# Altium project 农联网.PrjPcb
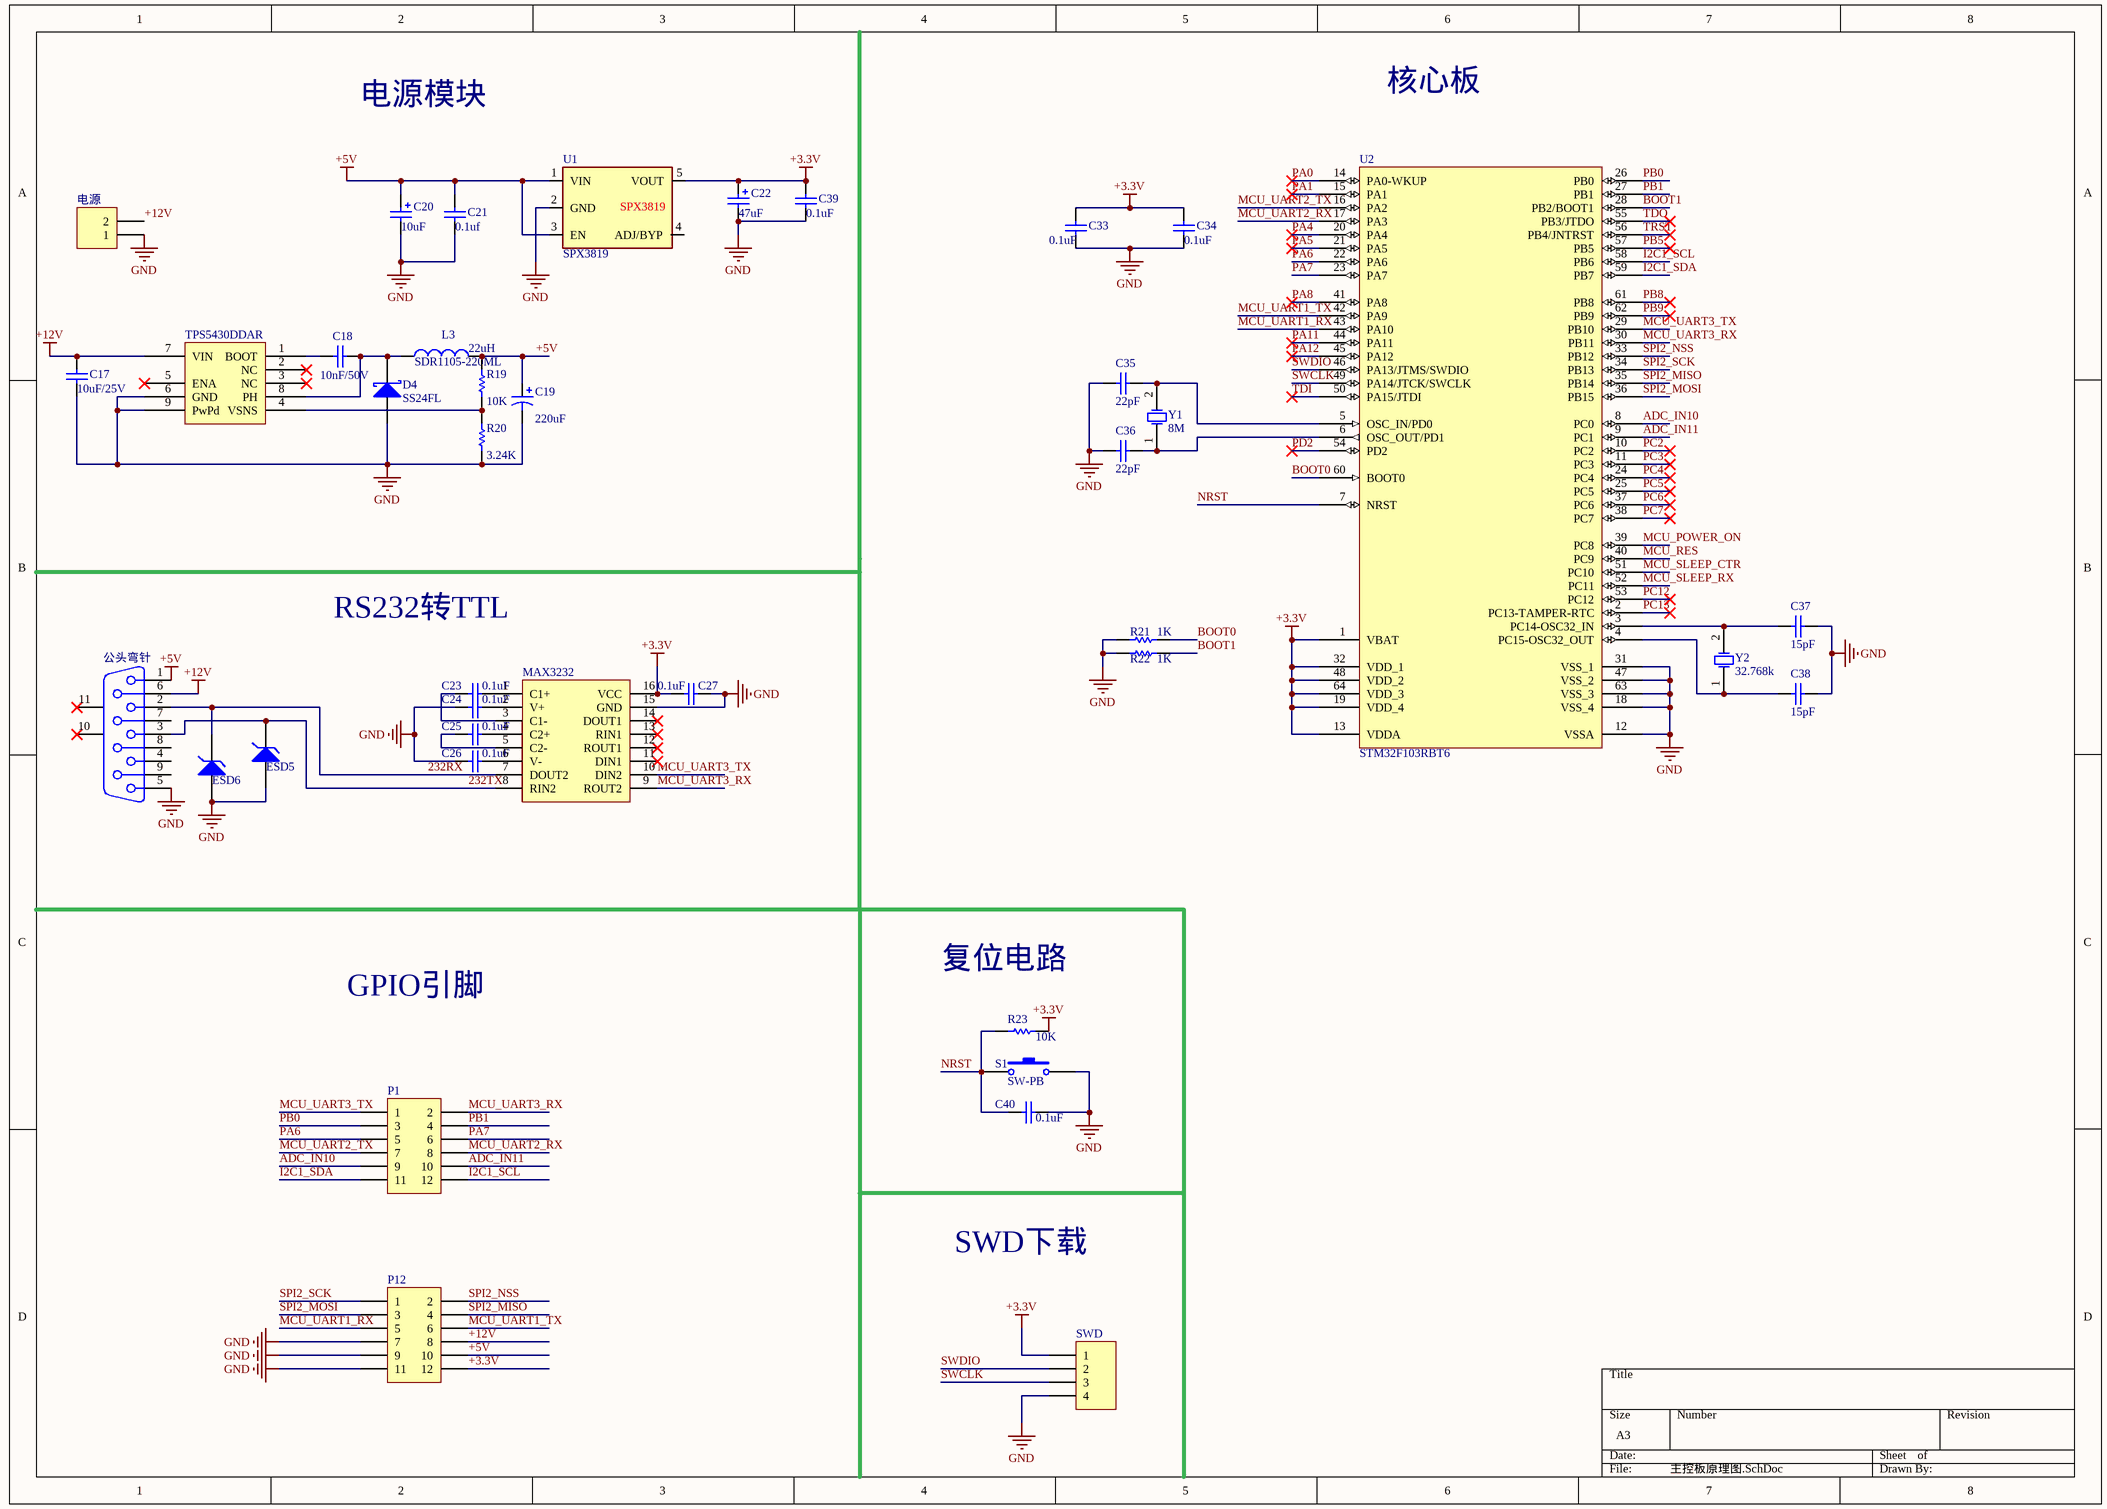
[diagram p0: 主控板原理图.SchDoc]
1 sheet, 40 parts. Net scope: global (net labels, ports and power ports of the same name join across sheets).
Board file: 农联网PCB.PcbDoc

## Sheet 主控板原理图.SchDoc
size A3

### Parts
C17  value 10uF/25V  [1206]  (hidden comment: GRM31CR61E106KA12L)
C18  value 10nF/50V  [0805]  (hidden comment: C0805C103K5RACTU)
C19  value 220uF  [钽电容(B)]  (hidden comment: 6TPE220MAZB)
C20  value 10uF  [1206]  (hidden comment: C1206-10uF)
C21  value 0.1uf  [0805]  (hidden comment: 104)
C22  value 47uF  [1206]  (hidden comment: C1206-47uF)
C23  value 0.1uF  [0805]  (hidden comment: 104)
C24  value 0.1uF  [0805]  (hidden comment: 104)
C25  value 0.1uF  [0805]  (hidden comment: 104)
C26  value 0.1uF  [0805]  (hidden comment: 104)
C27  value 0.1uF  [0805]  (hidden comment: 104)
C33  value 0.1uF  [0805]  (hidden comment: 104)
C34  value 0.1uF  [0805]  (hidden comment: 104)
C35  value 22pF  [0805]  (hidden comment: 22)
C36  value 22pF  [0805]  (hidden comment: 22)
C37  value 15pF  [0805]  (hidden comment: 15)
C38  value 15pF  [0805]  (hidden comment: 15)
C39  value 0.1uF  [0805]  (hidden comment: 104)
C40  value 0.1uF  [0805]  (hidden comment: 104)
D4  SS24FL  [SS24fl]
ESD5  SZESD7361HT1G  [0603]  (value not drawn)
ESD6  SZESD7361HT1G  [0603]  (value not drawn)
L3  SDR1105-220ML  value 22uH  [inductor]
MAX3232  MAX3232  [MAX3232]  (value not drawn)
P1  Header 6X2  [HDR6*2]  (value not drawn)
P12  Header 6X2  [HDR6*2]  (value not drawn)
R19  10K  [0805]
R20  3.24K  [0805]
R21  1K  [0805]
R22  1K  [0805]
R23  10K  [0805]
S1  SW-PB  [key]
SWD  Header 4  [SWD]  (value not drawn)
TPS5430DDAR  TPS5430DDAR  [TPS5430]  (value not drawn)
U1  SPX3819  [SOT-23-5]
U2  STM32F103RBT6  [STM32f103RBT6]
Y1  8M  [XTAL-B]
Y2  32.768k  [XTAL-B]
公头弯针  RS232公头弯针  [RS232]  (value not drawn)
电源  DUANZI  [DUANZI]  (value not drawn)

### Nets
+3.3V: C22.1 C27.2 C33.1 C34.1 C39.2 MAX3232.16(VCC) P12.12 R23.2 SWD.1 U1.5(VOUT) U2.1(VBAT) U2.13(VDDA) U2.19(VDD_4) U2.32(VDD_1) U2.48(VDD_2) U2.64(VDD_3)
+5V: C19.1 C20.1 C21.2 L3.2 P12.10 R19.2 U1.1(VIN) U1.3(EN) 公头弯针.1
+12V: C17.1 P12.8 TPS5430DDAR.7(VIN) 公头弯针.6 电源.2
GND: C17.2 C19.2 C20.2 C21.1 C22.2 C24.1 C26.1 C27.1 C33.2 C34.2 C35.1 C36.1 C37.2 C38.2 C39.1 C40.2 D4.1(A) ESD5.1(A) ESD6.1(A) MAX3232.15(GND) P12.7 P12.9 P12.11 R20.1 R21.2 R22.2 S1.2 SWD.4 TPS5430DDAR.6(GND) TPS5430DDAR.9(PwPd) U1.2(GND) U2.12(VSSA) U2.18(VSS_4) U2.31(VSS_1) U2.47(VSS_2) U2.63(VSS_3) 公头弯针.5 电源.1
232RX: ESD6.2(K) MAX3232.7(DOUT2) 公头弯针.2
232TX: ESD5.2(K) MAX3232.8(RIN2) 公头弯针.3
ADC_IN10: P1.9 U2.8(PC0)
ADC_IN11: P1.10 U2.9(PC1)
BOOT0: R21.1 U2.60(BOOT0)
BOOT1: R22.1 U2.28(PB2/BOOT1)
I2C1_SCL: P1.12 U2.58(PB6)
I2C1_SDA: P1.11 U2.59(PB7)
MCU_POWER_ON: U2.39(PC8)
MCU_RES: U2.40(PC9)
MCU_SLEEP_CTR: U2.51(PC10)
MCU_SLEEP_RX: U2.52(PC11)
MCU_UART1_RX: P12.5 U2.43(PA10)
MCU_UART1_TX: P12.6 U2.42(PA9)
MCU_UART2_RX: P1.8 U2.17(PA3)
MCU_UART2_TX: P1.7 U2.16(PA2)
MCU_UART3_RX: MAX3232.9(ROUT2) P1.2 U2.30(PB11)
MCU_UART3_TX: MAX3232.10(DIN2) P1.1 U2.29(PB10)
NRST: C40.1 R23.1 S1.1 U2.7(NRST)
PA0: U2.14(PA0-WKUP)
PA1: U2.15(PA1)
PA4: U2.20(PA4)
PA5: U2.21(PA5)
PA6: P1.5 U2.22(PA6)
PA7: P1.6 U2.23(PA7)
PA8: U2.41(PA8)
PA11: U2.44(PA11)
PA12: U2.45(PA12)
PB0: P1.3 U2.26(PB0)
PB1: P1.4 U2.27(PB1)
PB5: U2.57(PB5)
PB8: U2.61(PB8)
PB9: U2.62(PB9)
PC2: U2.10(PC2)
PC3: U2.11(PC3)
PC4: U2.24(PC4)
PC5: U2.25(PC5)
PC6: U2.37(PC6)
PC7: U2.38(PC7)
PC12: U2.53(PC12)
PC13: U2.2(PC13-TAMPER-RTC)
PD2: U2.54(PD2)
SPI2_MISO: P12.4 U2.35(PB14)
SPI2_MOSI: P12.3 U2.36(PB15)
SPI2_NSS: P12.2 U2.33(PB12)
SPI2_SCK: P12.1 U2.34(PB13)
SWCLK: SWD.3 U2.49(PA14/JTCK/SWCLK)
SWDIO: SWD.2 U2.46(PA13/JTMS/SWDIO)
TDI: U2.50(PA15/JTDI)
TDO: U2.55(PB3/JTDO)
TRST: U2.56(PB4/JNTRST)
NetC18_1: C18.1 TPS5430DDAR.1(BOOT)
NetC18_2: C18.2 D4.2(K) L3.1 TPS5430DDAR.8(PH)
NetC23_1: C23.1 MAX3232.3(C1-)
NetC23_2: C23.2 MAX3232.1(C1+)
NetC24_2: C24.2 MAX3232.2(V+)
NetC25_1: C25.1 MAX3232.5(C2-)
NetC25_2: C25.2 MAX3232.4(C2+)
NetC26_2: C26.2 MAX3232.6(V-)
NetC35_2: C35.2 U2.5(OSC_IN/PD0) Y1.2(OSC2)
NetC36_2: C36.2 U2.6(OSC_OUT/PD1) Y1.1(OSC1)
NetC37_1: C37.1 U2.3(PC14-OSC32_IN) Y2.2(OSC2)
NetC38_1: C38.1 U2.4(PC15-OSC32_OUT) Y2.1(OSC1)
NetR19_1: R19.1 R20.2 TPS5430DDAR.4(VSNS)

Not connected (* = marked no-connect by the designer): MAX3232 11(DIN1)* 12(ROUT1)* 13(RIN1)* 14(DOUT1)*; TPS5430DDAR 2(NC)* 3(NC)* 5(ENA)*; U1 4(ADJ/BYP); 公头弯针 4 7 8 9 10(MH1)* 11(MH2)*

### Notes on the sheet
- 电源模块
- 核心板
- RS232转TTL
- 复位电路
- GPIO引脚
- SWD下载

### Library data of the parts
C17 C18 C23-C27 C33-C38 C40 = Cap: Capacitor; Published: 8-Jun-2000; LatestRevisionDate: 17-Jul-2002; LatestRevisionNote: Re-released for DXP Platform.; PackageReference: RAD-0.3; Publisher: Altium Limited
  C17 C18 C23-C27 C40: PackageDescription: Radial Cap, Thru-Hole; 2 Leads; 0.3 in Pin Spacing
C19 = Cap Pol1: Polarized Capacitor (Radial); Published: 8-Jun-2000; LatestRevisionDate: 17-Jul-2002; LatestRevisionNote: Re-released for DXP Platform.; PackageReference: RB7.6-15; Publisher: Altium Limited; PackageDescription: Polarized Capacitor (Radial); 2 Leads
C20 C22 = C100uF
C21 C39 = C0.1uF
D4 = D Schottky: Schottky Diode; Published: 8-Jun-2000; LatestRevisionDate: 17-Jul-2002; LatestRevisionNote: Re-released for DXP Platform.; PackageReference: SMB; Publisher: Altium Limited; PackageDescription: DO-214-AA/SMB; 2 C-Bend Leads; Body 5.3 x 3.6 mm, inc. leads (LxW); Code_JEDEC: DO-214-AA
ESD5 ESD6 = D Zener: Zener Diode; Published: 8-Jun-2000; LatestRevisionDate: 17-Jul-2002; LatestRevisionNote: Re-released for DXP Platform.; PackageReference: DIODE-0.7; Publisher: Altium Limited; PackageDescription: Diode, Thru-Hole; 2 Leads; 0.7 in Pin Spacing
L3 = Inductor: Code_IEC: 1005; Published: 8-Jun-2000; LatestRevisionDate: 29-May-2009; LatestRevisionNote: IPC-7351 Footprint Added.; PackageReference: 0402-A; Publisher: Altium Limited; PackageDescription: Chip Inductor; Code_JEITA: 0402
MAX3232 = MAX232
P1 P12 = Header 6X2: Header, 6-Pin, Dual row; LatestRevisionDate: 17-Jul-2002; LatestRevisionNote: Re-released for DXP Platform.; Publisher: Altium Limited
R19-R23 = Res1: Resistor; Published: 8-Jun-2000; LatestRevisionDate: 17-Jul-2002; LatestRevisionNote: Re-released for DXP Platform.; PackageReference: AXIAL-0.3; Publisher: Altium Limited; PackageDescription: Axial Device, Thru-Hole; 2 Leads; 0.3 in Pin Spacing
  R19 R23: Value: 10K
  R20: Value: 3.24K
  R21 R22: Value: 1K
S1 = SW-PB: Switch; Published: 24-Mar-1999; LatestRevisionDate: 17-Jul-2002; LatestRevisionNote: Re-released for DXP Platform.; PackageReference: SPST-2; Publisher: Altium Limited; PackageDescription: Switch; 2 Leads
SWD = Header 4: Header, 4-Pin; LatestRevisionDate: 17-Jul-2002; LatestRevisionNote: Re-released for DXP Platform.; Publisher: Altium Limited
TPS5430DDAR = TPS5430
U2 = STM32F103RBT6: STM32 ARM-based 32-bit MCU with 128 Kbytes Flash, 64-pin LQFP, Industrial Temperature; Published: 30-May-2008; DatasheetVersion: rev6, Mar-2008; PackageVersion: Mar-2008; PackageReference: LQFP64; Publisher: Altium Limited; PackageDescription: 64-Pin Low-Profile Quad Flat Pack, 10 x 10 mm Body, 0.5 mm Pitch (LQFP64); ComponentLink1Description: Manufacturer Link; ComponentLink1URL: www.st.com/stm32; ComponentLink2Description: Datasheet; ComponentLink2URL: http://www.st.com/stonline/products/literature/ds/13587.pdf
Y1 Y2 = XTAL: Crystal Oscillator; Published: 8-Jun-2000; LatestRevisionDate: 17-Jul-2002; LatestRevisionNote: Re-released for DXP Platform.; PackageReference: R38; Publisher: Altium Limited
公头弯针 = D Connector 9: Receptacle Assembly, 9 Position, Right Angle; PackageDocument: O; Positions: 9; Published: 15-Jun-2001; LatestRevisionDate: 17-Jul-2002; LatestRevisionNote: Re-released for DXP Platform.; DatasheetDocument: 1-Sep-1999; PackageReference: 788750; Publisher: Altium Limited; Orientation: Right Angle; Gender: Receptacle
电源 = Header 2: Header, 2-Pin; LatestRevisionDate: 17-Jul-2002; LatestRevisionNote: Re-released for DXP Platform.; Publisher: Altium Limited